# Altium schematic sheet sensor_array.SchDoc: Magic Baton: Sensor Array
size Letter
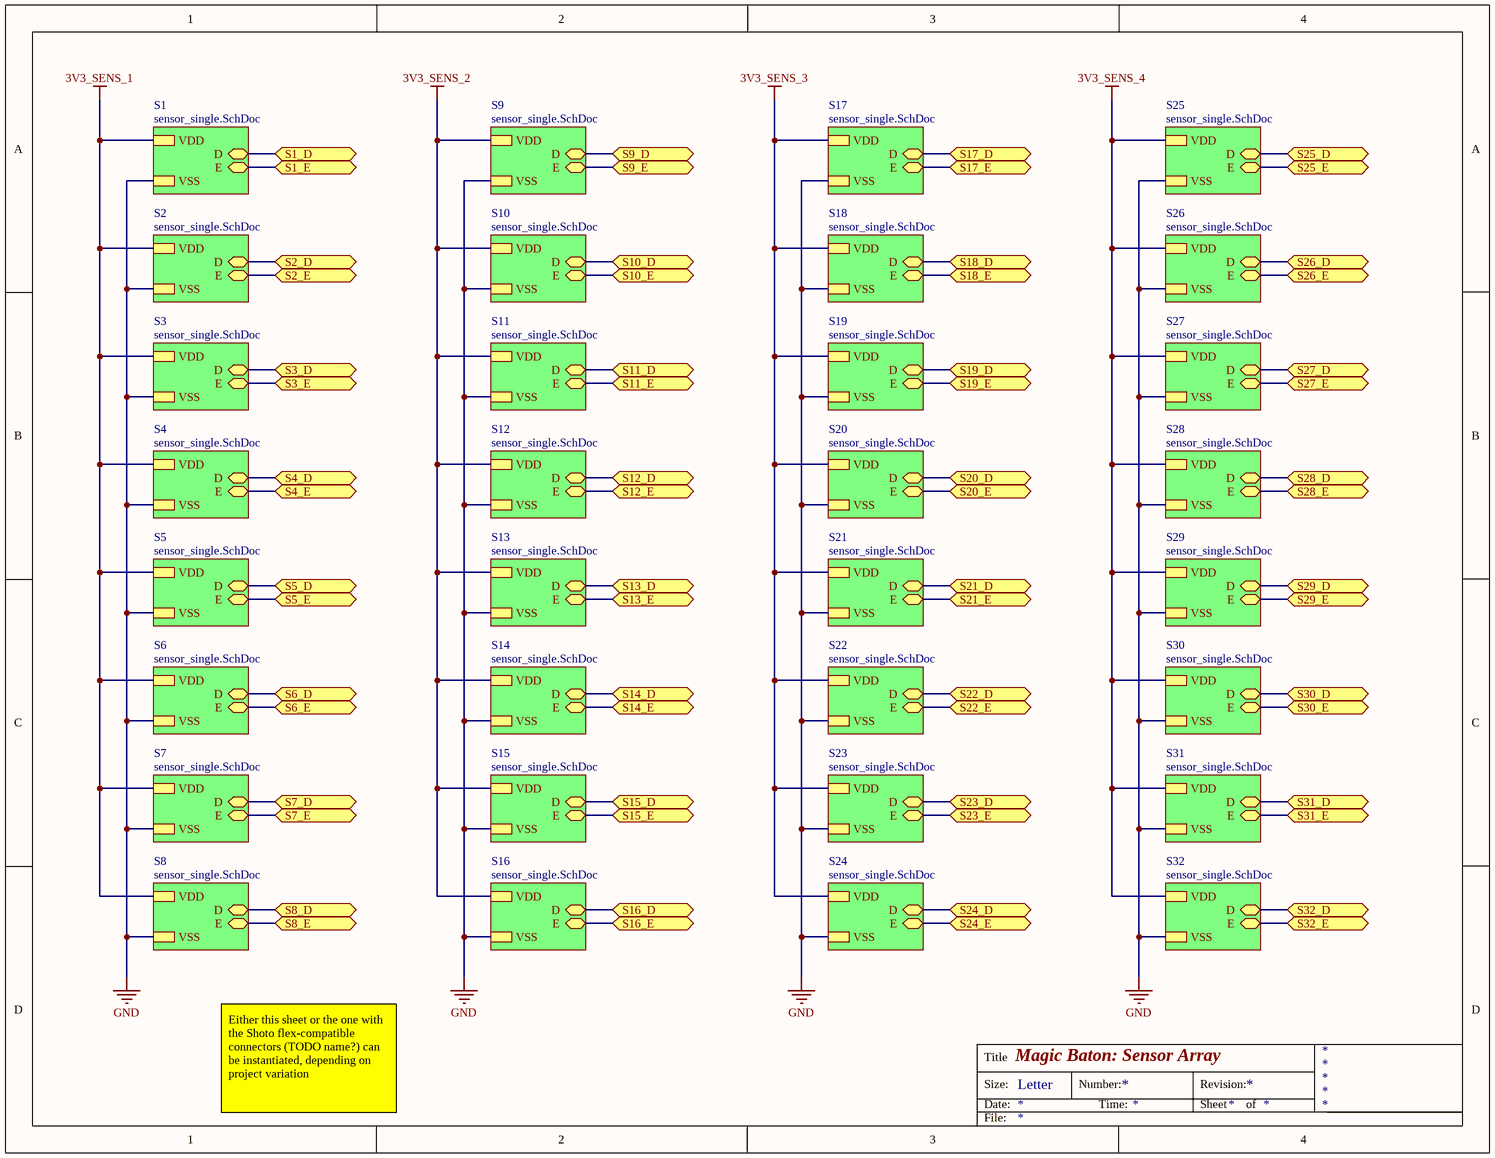
[diagram p0: sensor_array.SchDoc]

## Sub-sheets
S1 = sensor_single.SchDoc: D (bidir), E (bidir), VDD, VSS
S2 = sensor_single.SchDoc: D (bidir), E (bidir), VDD, VSS
S3 = sensor_single.SchDoc: D (bidir), E (bidir), VDD, VSS
S4 = sensor_single.SchDoc: D (bidir), E (bidir), VDD, VSS
S5 = sensor_single.SchDoc: D (bidir), E (bidir), VDD, VSS
S6 = sensor_single.SchDoc: D (bidir), E (bidir), VDD, VSS
S7 = sensor_single.SchDoc: D (bidir), E (bidir), VDD, VSS
S8 = sensor_single.SchDoc: D (bidir), E (bidir), VDD, VSS
S9 = sensor_single.SchDoc: D (bidir), E (bidir), VDD, VSS
S10 = sensor_single.SchDoc: D (bidir), E (bidir), VDD, VSS
S11 = sensor_single.SchDoc: D (bidir), E (bidir), VDD, VSS
S12 = sensor_single.SchDoc: D (bidir), E (bidir), VDD, VSS
S13 = sensor_single.SchDoc: D (bidir), E (bidir), VDD, VSS
S14 = sensor_single.SchDoc: D (bidir), E (bidir), VDD, VSS
S15 = sensor_single.SchDoc: D (bidir), E (bidir), VDD, VSS
S16 = sensor_single.SchDoc: D (bidir), E (bidir), VDD, VSS
S17 = sensor_single.SchDoc: D (bidir), E (bidir), VDD, VSS
S18 = sensor_single.SchDoc: D (bidir), E (bidir), VDD, VSS
S19 = sensor_single.SchDoc: D (bidir), E (bidir), VDD, VSS
S20 = sensor_single.SchDoc: D (bidir), E (bidir), VDD, VSS
S21 = sensor_single.SchDoc: D (bidir), E (bidir), VDD, VSS
S22 = sensor_single.SchDoc: D (bidir), E (bidir), VDD, VSS
S23 = sensor_single.SchDoc: D (bidir), E (bidir), VDD, VSS
S24 = sensor_single.SchDoc: D (bidir), E (bidir), VDD, VSS
S25 = sensor_single.SchDoc: D (bidir), E (bidir), VDD, VSS
S26 = sensor_single.SchDoc: D (bidir), E (bidir), VDD, VSS
S27 = sensor_single.SchDoc: D (bidir), E (bidir), VDD, VSS
S28 = sensor_single.SchDoc: D (bidir), E (bidir), VDD, VSS
S29 = sensor_single.SchDoc: D (bidir), E (bidir), VDD, VSS
S30 = sensor_single.SchDoc: D (bidir), E (bidir), VDD, VSS
S31 = sensor_single.SchDoc: D (bidir), E (bidir), VDD, VSS
S32 = sensor_single.SchDoc: D (bidir), E (bidir), VDD, VSS

## Ports
S1_D (bidir), S1_E (bidir), S2_D (bidir), S2_E (bidir), S3_D (bidir), S3_E (bidir), S4_D (bidir), S4_E (bidir), S5_D (bidir), S5_E (bidir), S6_D (bidir), S6_E (bidir), S7_D (bidir), S7_E (bidir), S8_D (bidir), S8_E (bidir), S9_D (bidir), S9_E (bidir), S10_D (bidir), S10_E (bidir), S11_D (bidir), S11_E (bidir), S12_D (bidir), S12_E (bidir), S13_D (bidir), S13_E (bidir), S14_D (bidir), S14_E (bidir), S15_D (bidir), S15_E (bidir), S16_D (bidir), S16_E (bidir), S17_D (bidir), S17_E (bidir), S18_D (bidir), S18_E (bidir), S19_D (bidir), S19_E (bidir), S20_D (bidir), S20_E (bidir), S21_D (bidir), S21_E (bidir), S22_D (bidir), S22_E (bidir), S23_D (bidir), S23_E (bidir), S24_D (bidir), S24_E (bidir), S25_D (bidir), S25_E (bidir), S26_D (bidir), S26_E (bidir), S27_D (bidir), S27_E (bidir), S28_D (bidir), S28_E (bidir), S29_D (bidir), S29_E (bidir), S30_D (bidir), S30_E (bidir), S31_D (bidir), S31_E (bidir), S32_D (bidir), S32_E (bidir)

## Nets
3V3_SENS_1: sheet S1/VDD, sheet S8/VDD, sheet S7/VDD, sheet S6/VDD, sheet S5/VDD, sheet S4/VDD, sheet S3/VDD, sheet S2/VDD
3V3_SENS_2: sheet S9/VDD, sheet S16/VDD, sheet S15/VDD, sheet S14/VDD, sheet S13/VDD, sheet S12/VDD, sheet S11/VDD, sheet S10/VDD
3V3_SENS_3: sheet S17/VDD, sheet S24/VDD, sheet S23/VDD, sheet S22/VDD, sheet S21/VDD, sheet S20/VDD, sheet S19/VDD, sheet S18/VDD
3V3_SENS_4: sheet S25/VDD, sheet S32/VDD, sheet S31/VDD, sheet S30/VDD, sheet S29/VDD, sheet S28/VDD, sheet S27/VDD, sheet S26/VDD
GND: sheet S1/VSS, sheet S8/VSS, sheet S7/VSS, sheet S6/VSS, sheet S5/VSS, sheet S4/VSS, sheet S3/VSS, sheet S2/VSS, sheet S9/VSS, sheet S16/VSS, sheet S15/VSS, sheet S14/VSS, sheet S13/VSS, sheet S12/VSS, sheet S11/VSS, sheet S10/VSS, sheet S17/VSS, sheet S24/VSS, sheet S23/VSS, sheet S22/VSS, sheet S21/VSS, sheet S20/VSS, sheet S19/VSS, sheet S18/VSS, sheet S25/VSS, sheet S32/VSS, sheet S31/VSS, sheet S30/VSS, sheet S29/VSS, sheet S28/VSS, sheet S27/VSS, sheet S26/VSS
S1_D: port S1_D, sheet S1/D
S1_E: port S1_E, sheet S1/E
S2_D: port S2_D, sheet S2/D
S2_E: port S2_E, sheet S2/E
S3_D: port S3_D, sheet S3/D
S3_E: port S3_E, sheet S3/E
S4_D: port S4_D, sheet S4/D
S4_E: port S4_E, sheet S4/E
S5_D: port S5_D, sheet S5/D
S5_E: port S5_E, sheet S5/E
S6_D: port S6_D, sheet S6/D
S6_E: port S6_E, sheet S6/E
S7_D: port S7_D, sheet S7/D
S7_E: port S7_E, sheet S7/E
S8_D: port S8_D, sheet S8/D
S8_E: port S8_E, sheet S8/E
S9_D: port S9_D, sheet S9/D
S9_E: port S9_E, sheet S9/E
S10_D: port S10_D, sheet S10/D
S10_E: port S10_E, sheet S10/E
S11_D: port S11_D, sheet S11/D
S11_E: port S11_E, sheet S11/E
S12_D: port S12_D, sheet S12/D
S12_E: port S12_E, sheet S12/E
S13_D: port S13_D, sheet S13/D
S13_E: port S13_E, sheet S13/E
S14_D: port S14_D, sheet S14/D
S14_E: port S14_E, sheet S14/E
S15_D: port S15_D, sheet S15/D
S15_E: port S15_E, sheet S15/E
S16_D: port S16_D, sheet S16/D
S16_E: port S16_E, sheet S16/E
S17_D: port S17_D, sheet S17/D
S17_E: port S17_E, sheet S17/E
S18_D: port S18_D, sheet S18/D
S18_E: port S18_E, sheet S18/E
S19_D: port S19_D, sheet S19/D
S19_E: port S19_E, sheet S19/E
S20_D: port S20_D, sheet S20/D
S20_E: port S20_E, sheet S20/E
S21_D: port S21_D, sheet S21/D
S21_E: port S21_E, sheet S21/E
S22_D: port S22_D, sheet S22/D
S22_E: port S22_E, sheet S22/E
S23_D: port S23_D, sheet S23/D
S23_E: port S23_E, sheet S23/E
S24_D: port S24_D, sheet S24/D
S24_E: port S24_E, sheet S24/E
S25_D: port S25_D, sheet S25/D
S25_E: port S25_E, sheet S25/E
S26_D: port S26_D, sheet S26/D
S26_E: port S26_E, sheet S26/E
S27_D: port S27_D, sheet S27/D
S27_E: port S27_E, sheet S27/E
S28_D: port S28_D, sheet S28/D
S28_E: port S28_E, sheet S28/E
S29_D: port S29_D, sheet S29/D
S29_E: port S29_E, sheet S29/E
S30_D: port S30_D, sheet S30/D
S30_E: port S30_E, sheet S30/E
S31_D: port S31_D, sheet S31/D
S31_E: port S31_E, sheet S31/E
S32_D: port S32_D, sheet S32/D
S32_E: port S32_E, sheet S32/E

## Notes on the sheet
- Either this sheet or the one with the Shoto flex-compatible connectors (TODO name?) can be instantiated, depending on project variation
- Title
- Size:
- Date:
- Letter
- Number:
- Time:
- Revision:
- Sheet
- of
- File: